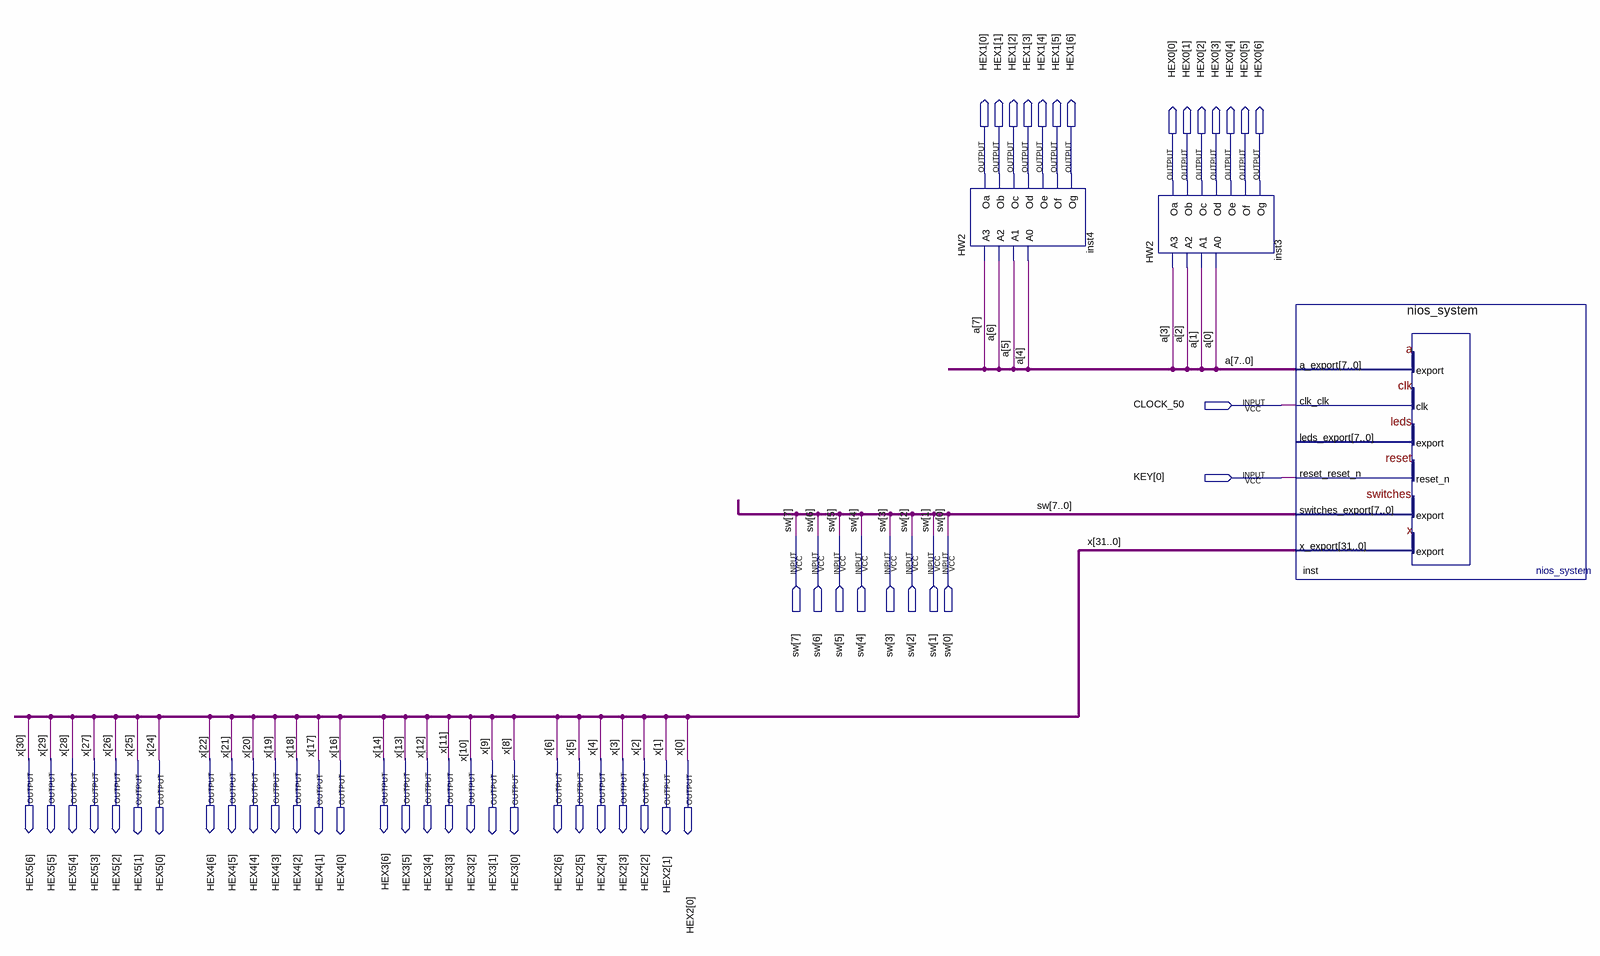
[diagram p0: schematic sheet]
// Quartus schematic hw07.bdf as structural Verilog: 3 symbols, 52 pins
module hw07 (
  input  CLOCK_50,
  input  [0:0] KEY,
  input  [7:0] sw,
  output [6:0] HEX1,
  output [6:0] HEX0,
  output [6:0] HEX5,
  output [6:0] HEX4,
  output [6:0] HEX3,
  output [6:0] HEX2
);

  wire [7:0] a;
  wire [31:7] x;

  HW2 inst4 (
    .A3(a[7]), .A2(a[6]), .A1(a[5]), .A0(a[4]), .Oa(HEX1[0]), .Ob(HEX1[1]), .Oc(HEX1[2]), .Od(HEX1[3]),
    .Oe(HEX1[4]), .Of(HEX1[5]), .Og(HEX1[6]));
  HW2 inst3 (
    .A3(a[3]), .A2(a[2]), .A1(a[1]), .A0(a[0]), .Oa(HEX0[0]), .Ob(HEX0[1]), .Oc(HEX0[2]), .Od(HEX0[3]),
    .Oe(HEX0[4]), .Of(HEX0[5]), .Og(HEX0[6]));
  nios_system inst (
    .clk_clk(CLOCK_50), .reset_reset_n(KEY[0]), .switches_export(sw), .a_export(a),
    .x_export({x[31], HEX5, x[23], HEX4, x[15], HEX3, x[7], HEX2}));  // open: leds_export

  // Other names for the same wires on the sheet: x (some bits) = {HEX5, HEX4, HEX3, HEX2}
endmodule
